# Altium schematic sheet Power_Regulators_RF_1.SchDoc
size A4; DocumentNumber: 35; SheetNumber: 35; SheetTotal: 47
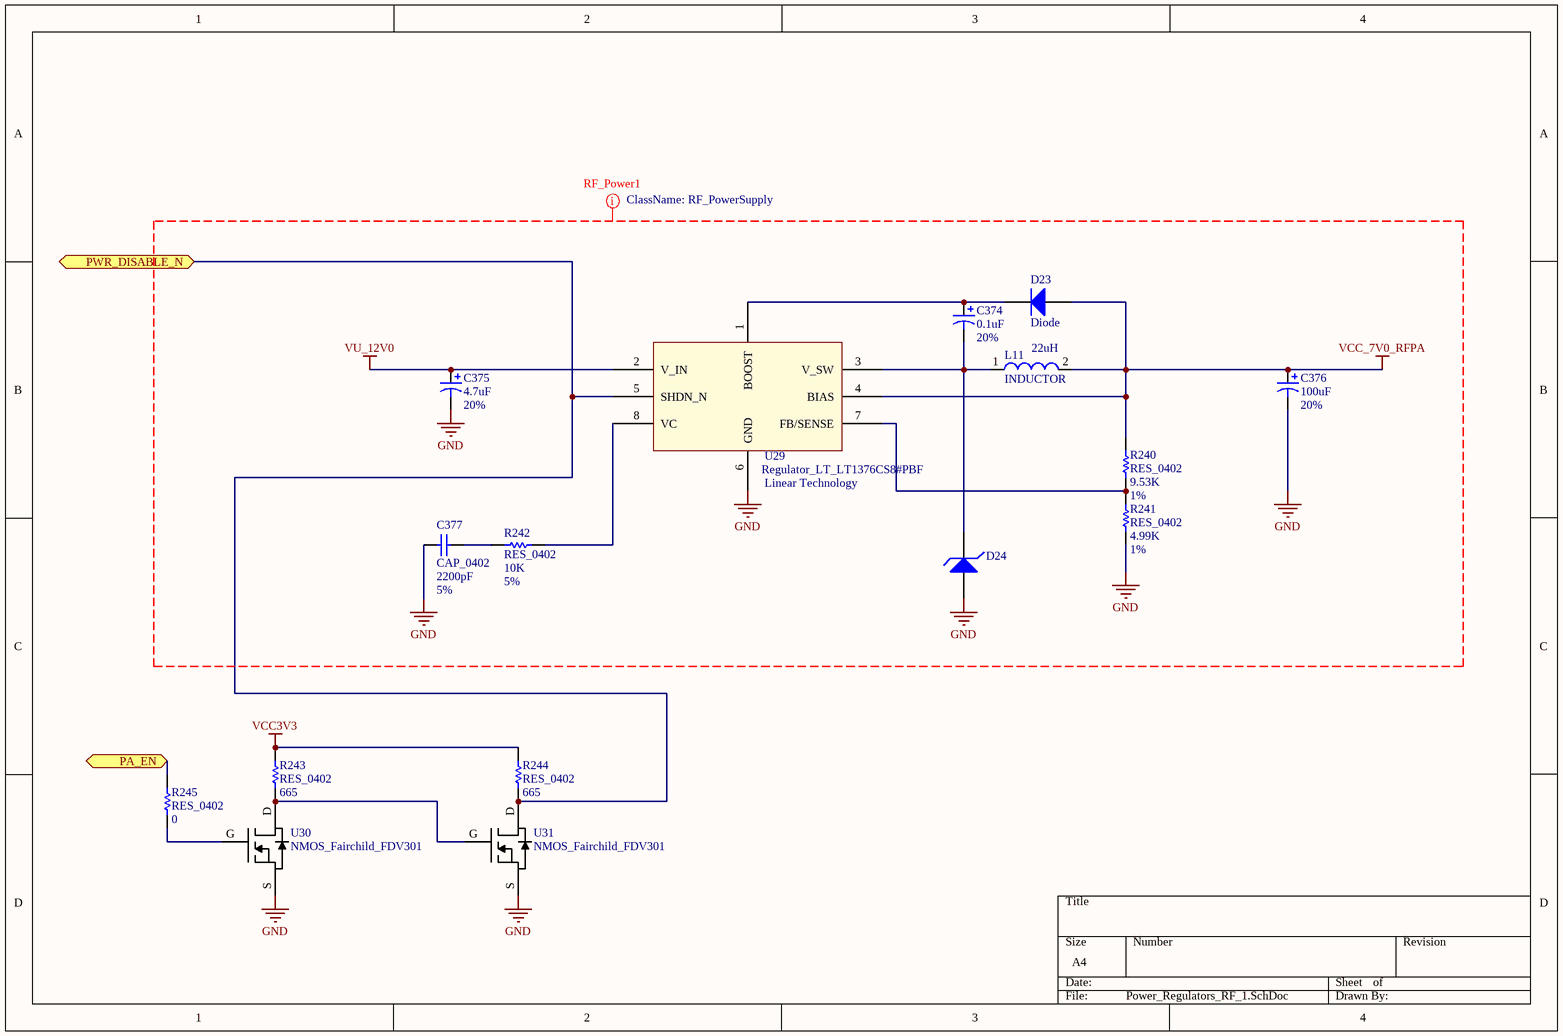
[diagram p0: Power_Regulators_RF_1.SchDoc]

## Parts
C374  value 0.1uF  Tolerance: 20%  [Polarized_CAPC1206(3216)]  (hidden comment: Cap Pol1)
C375  value 4.7uF  Tolerance: 20%  [Polarized_CAPC1206(3216)]  (hidden comment: Cap Pol1)
C376  value 100uF  Tolerance: 20%  [Polarized_CAPC1210(3225)]  (hidden comment: Cap Pol1)
C377  CAP_0402  value 2200pF  Tolerance: 5%  [CAPC0402(1005)60_N]
D23  Diode  [Diode_DB2J31700L_2-PIN]
D24  Shottky Diode  [SchottkyDiode_SS2P2-M384A_2-PIN]  (value not drawn)
L11  INDUCTOR  value 22uH  [Inductor_IHSM4825ER_2-PIN]
R240  RES_0402  value 9.53K  Tolerance: 1%  [RESC0402(1005)_N]
R241  RES_0402  value 4.99K  Tolerance: 1%  [RESC0402(1005)_N]
R242  RES_0402  value 10K  Tolerance: 5%  [RESC0402(1005)_N]
R243  RES_0402  value 665  [RESC0402(1005)_N]
R244  RES_0402  value 665  [RESC0402(1005)_N]
R245  RES_0402  value 0  [RESC0402(1005)_N]
U29  Regulator_LT_LT1376CS8#PBF  Manufacturer: Linear Technology  [LT1376CS8#PBF_8SOIC]
U30  NMOS_Fairchild_FDV301  [NMOS_Fairchild_FDV301_SOT23-3]
U31  NMOS_Fairchild_FDV301  [NMOS_Fairchild_FDV301_SOT23-3]

## Ports
PA_EN (bidir), PWR_DISABLE_N (bidir)

## Nets
GND: C375.2 C376.2 C377.1 D24.2(A) R241.1 U29.6(GND) U30.S U31.S
VCC3V3: R243.2 R244.2
VCC_7V0_RFPA: C376.1 D23.2(A) L11.2 R240.2 U29.4(BIAS)
VU_12V0: C375.1 U29.2(V_IN)
PA_EN: R245.2 ; port PA_EN
PWR_DISABLE_N: R244.1 U29.5(SHDN_N) U31.D ; port PWR_DISABLE_N
NetC374_1: C374.1 D23.1(K) U29.1(BOOST)
NetC374_2: C374.2 D24.1(K) L11.1 U29.3(V_SW)
NetC377_2: C377.2 R242.1
NetR240_1: R240.1 R241.2 U29.7(FB/SENSE)
NetR242_2: R242.2 U29.8(VC)
NetR243_1: R243.1 U30.D U31.G
NetR245_1: R245.1 U30.G

## Layout directives
net class RF_PowerSupply: GND, VCC_7V0_RFPA, VU_12V0

## Library data of the parts
C374 = T491A104M035AT: CAP TANT 0.1UF 35V 20% 1206; Manufacturer: Kemet; Part Number: T491A104M035AT; Footprint Ref: Polarized_CAPC1206(3216); Library Ref: Cap Pol1
C375 = T491A475M025AT: CAP TANT 4.7UF 25V 20% 1206; Manufacturer: Kemet; Part Number: T491A475M025AT; Footprint Ref: Polarized_CAPC1206(3216); Library Ref: Cap Pol1
C376 = TLCT107M010XTA: 100uF, tantalum, 20% 10V, 1210; Manufacturer: AVX Corporation; Part Number: TLCT107M010XTA; Footprint Ref: Polarized_CAPC1210(3225); Library Ref: Cap Pol1
C377 = C1005SL1A222J: CAP CER 2200PF 10V 5% SL 0402; Manufacturer: TDK Corporation; Part Number: C1005SL1A222J; Footprint Ref: CAPC0402(1005)60_N; Library Ref: CAP_0402
D23 = DB2J31700L: DIODE 30V 1A SMINI2; Manufacturer: Panasonic Electronic Components - Semiconductor Products; Part Number: DB2J31700L; Footprint Ref: Diode_DB2J31700L_2-PIN; Library Ref: Diode
D24 = SS2P2-M3/84A: DIODE SCHOTTKY 2A 20V SMP; Manufacturer: Vishay Semiconductor Diodes Division; Part Number: SS2P2-M3/84A; Footprint Ref: SchottkyDiode_SS2P2-M384A_2-PIN; Library Ref: ShottkyDiode
L11 = IHSM4825ER2R0L: Surface Mount Inductor,22uH,1.7A; Manufacturer: Vishay Dale; Tolerance: *; Part Number: IHSM4825ER2R0L; Footprint Ref: Inductor_IHSM4825ER_2-PIN; Library Ref: INDUCTOR
R240 = ERJ-2RKF9531X: RES 9.53K OHM 1/10W 1% 0402 SMD; Manufacturer: Panasonic Electronic Components; Part Number: ERJ-2RKF9531X; Footprint Ref: RESC0402(1005)_N; Library Ref: RES_0402
R241 = CRCW04024K99FKED: 4.99K ohm, 1% 1/16W, 0402; Manufacturer: Vishay/Dale; Part Number: CRCW04024K99FKED; Footprint Ref: RESC0402(1005)_N; Library Ref: RES_0402
R242 = RC0402JR-0710KL: 10K ohm, 5%, 1/16W, 0402; Manufacturer: Yageo America; Part Number: RC0402JR-0710KL; Footprint Ref: RESC0402(1005)_N; Library Ref: RES_0402
R243 R244 = ERJ-2RKF6650X: RES 665 OHM 1/10W 1% 0402 SMD; Manufacturer: Panasonic Electronic Components; Tolerance: *; Part Number: ERJ-2RKF6650X; Footprint Ref: RESC0402(1005)_N; Library Ref: RES_0402
R245 = RC0402JR-070RL: 0.0 ohm shunt, 5%, 1/16W, 0402; Manufacturer: Yageo America; Tolerance: 5%; Part Number: RC0402JR-070RL
U29 = LT1376CS8#PBF: IC REG BUCK ADJ 1.5A 8SOIC; Part Number: LT1376CS8#PBF; Footprint Ref: LT1376CS8#PBF_8SOIC; Library Ref: Regulator_LT_LT1376CS8#PBF
U30 U31 = FDV301N: MOSFET N-CH 25V 220MA SOT-23; Manufacturer: Fairchild Semiconductor; Part Number: FDV301N; Footprint Ref: NMOS_Fairchild_FDV301_SOT23-3; Library Ref: NMOS_Fairchild_FDV301